# EAGLE schematic LRT_arduino_v2a (EAGLE 7.6.0)

## Sheet 1 of 4: MAIN CONTROLLER
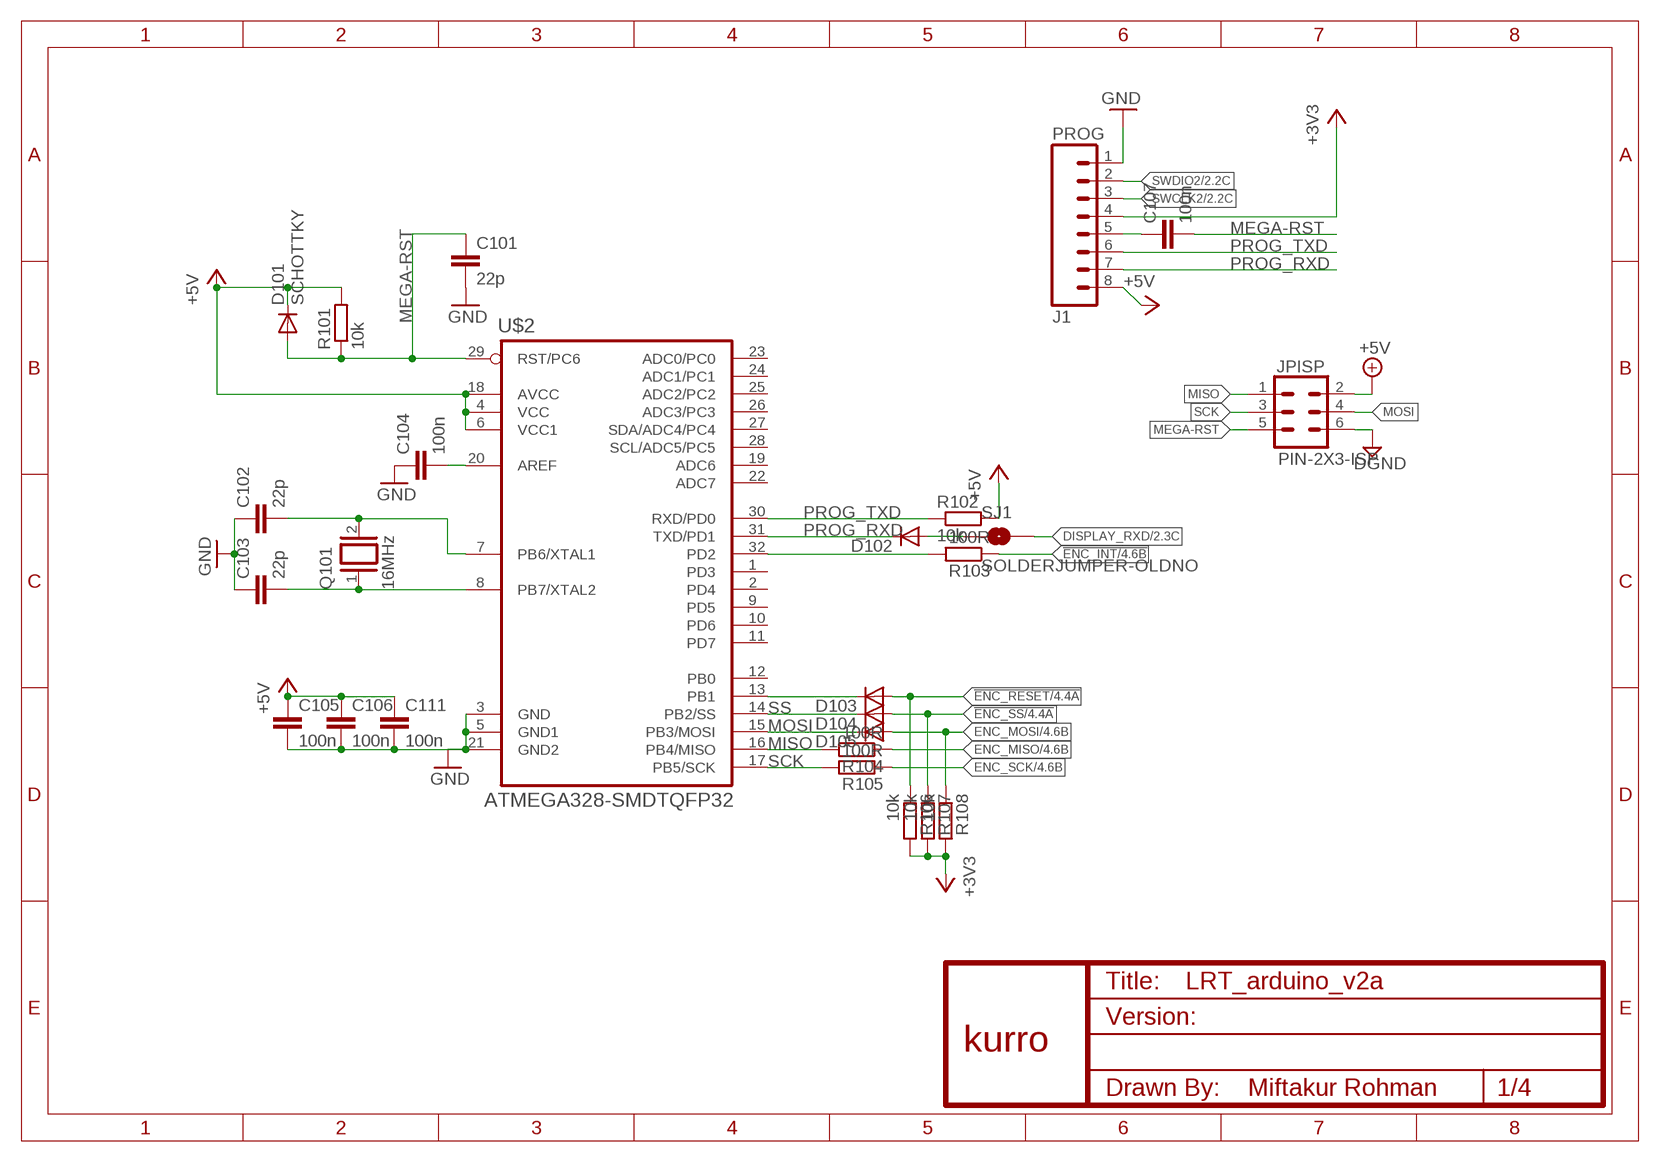
[diagram p0: schematic, sheet 1]

### Parts
C101  22p  C-EUC0603  [C0603]
C102  22p  C-EUC0603  [C0603]
C103  22p  C-EUC0603  [C0603]
C104  100n  C-EUC0603  [C0603]
C105  100n  C-EUC0603  [C0603]
C106  100n  C-EUC0603  [C0603]
C107  100n  C-EUC0603  [C0603]
C111  100n  C-EUC0603  [C0603]
D101  SCHOTTKY  DIODE-MICROMELF-W  [MICROMELF-W]
D102  DIODE-MICROMELF-W  [MICROMELF-W]
D103  DIODE-MICROMELF-W  [MICROMELF-W]
D104  DIODE-MICROMELF-W  [MICROMELF-W]
D105  DIODE-MICROMELF-W  [MICROMELF-W]
J1  PROG  M08-XH-RA  [XH-8-RA]
JPISP  PIN-2X3-ISP  PINHEAD-2X3-ISP  [2X03]
Q101  16MHz  XTAL/S  [QS]
R101  10k  R-EU_R0603  [R0603]
R102  10k  R-EU_R0603  [R0603]
R103  100R  R-EU_R0603  [R0603]
R104  100R  R-EU_R0603  [R0603]
R105  100R  R-EU_R0603  [R0603]
R106  10k  R-EU_R0603  [R0603]
R107  10k  R-EU_R0603  [R0603]
R108  10k  R-EU_R0603  [R0603]
SJ1  SOLDERJUMPER-OLDNO  [SJ_2S-NO]
U$1  KURRO_FOOTPRINT  [KURRO-LOGO]
U$2  ATMEGA328-SMDTQFP32  [TQFP32]

### Nets
!ENC_INT: R103.1 ; also sheet 4
!ENC_RESET: D103.A R106.1 ; also sheet 4
!ENC_SS: D104.A R107.1 ; also sheet 4
+3V3: J1.4 R106.2 R107.2 R108.2 ; also sheet 2,3,4
+5V: C105.1 C106.1 C111.1 D101.C J1.8 JPISP.2 R101.2 R102.2 U$2.4(VCC) U$2.6(VCC1) U$2.18(AVCC) ; also sheet 3
DISPLAY_RXD [ic]: SJ1.2 ; also sheet 2
ENC_MISO: R104.1 ; also sheet 4
ENC_MOSI: D105.A R108.1 ; also sheet 4
ENC_SCK: R105.1 ; also sheet 4
GND: C101.2 C102.1 C103.1 C104.1 C105.2 C106.2 C111.2 J1.1 JPISP.6 U$2.3(GND) U$2.5(GND1) U$2.21(GND2) ; supply symbol labelled DGND ; also sheet 2,3,4
MEGA-RST [ic]: C101.1 C107.2 D101.A JPISP.5 R101.1 U$2.29(RST/PC6)
MISO: JPISP.1 R104.2 U$2.16(PB4/MISO)
MOSI: D105.C JPISP.4 U$2.15(PB3/MOSI)
N$25: C104.2 U$2.20(AREF)
N$26: C103.2 Q101.1 U$2.8(PB7/XTAL2)
N$31: C102.2 Q101.2 U$2.7(PB6/XTAL1)
N$35: R103.2 U$2.32(PD2)
N$37 [ic]: C107.1 J1.5
N$39: D103.C U$2.13(PB1)
N$40: D102.A SJ1.1
PROG_RXD: D102.C J1.7 U$2.31(TXD/PD1)
PROG_TXD: J1.6 R102.1 U$2.30(RXD/PD0)
SCK: JPISP.3 R105.2 U$2.17(PB5/SCK)
SS: D104.C U$2.14(PB2/SS)
SWCLK2 [ic]: J1.3 ; also sheet 2
SWDIO2 [ic]: J1.2 ; also sheet 2
Unconnected: U$2.1(PD3) U$2.2(PD4) U$2.9(PD5) U$2.10(PD6) U$2.11(PD7) U$2.12(PB0) U$2.19(ADC6) U$2.22(ADC7) U$2.23(ADC0/PC0) U$2.24(ADC1/PC1) U$2.25(ADC2/PC2) U$2.26(ADC3/PC3) U$2.27(SDA/ADC4/PC4) U$2.28(SCL/ADC5/PC5)

## Sheet 2 of 4: DISPLAY_CONTROLLER
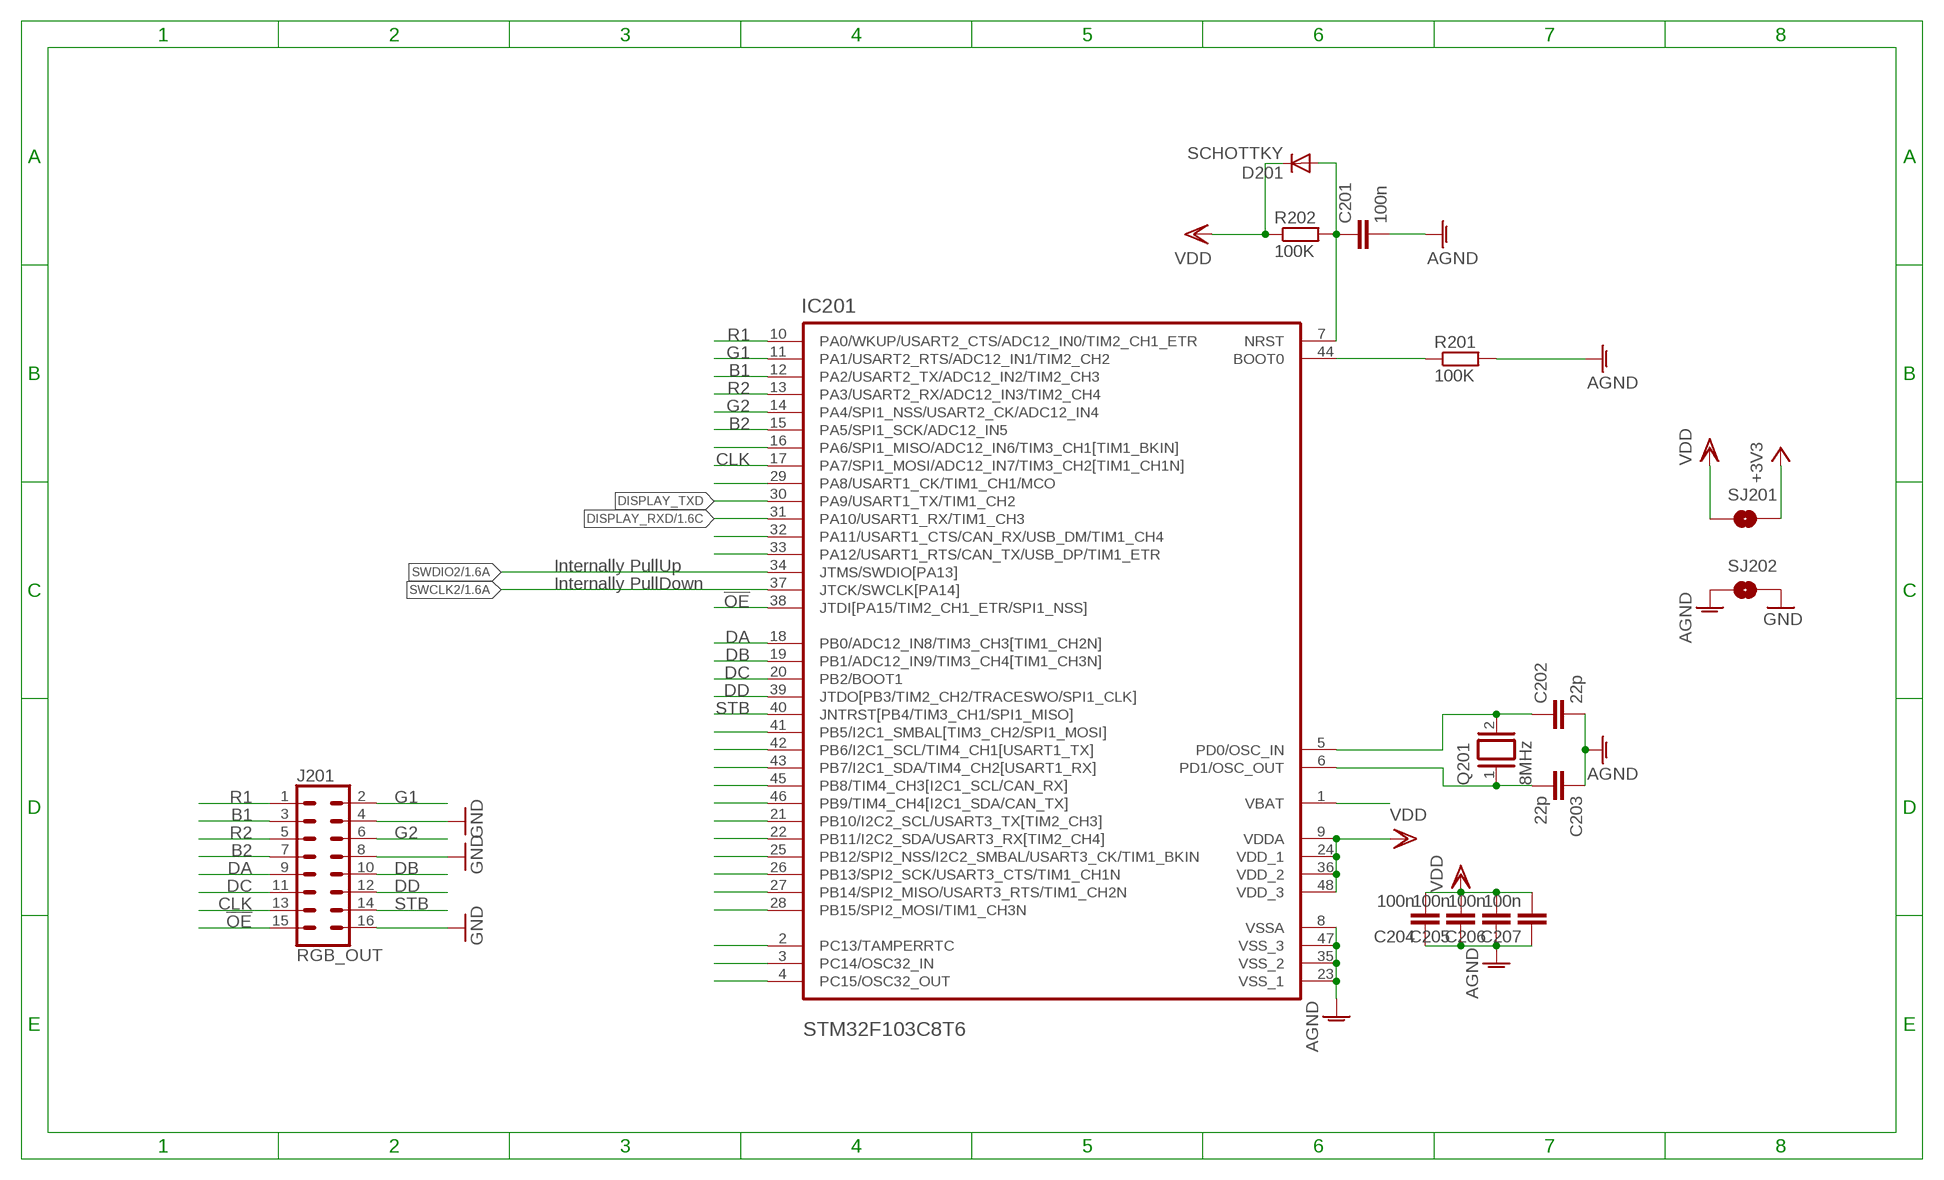
[diagram p1: schematic, sheet 2]

### Parts
C201  100n  C-EUC0603  [C0603]
C202  22p  C-EUC0603  [C0603]
C203  22p  C-EUC0603  [C0603]
C204  100n  C-EUC0603  [C0603]
C205  100n  C-EUC0603  [C0603]
C206  100n  C-EUC0603  [C0603]
C207  100n  C-EUC0603  [C0603]
D201  SCHOTTKY  DIODE-MICROMELF-W  [MICROMELF-W]
IC201  STM32F103C8T6  [QFP50P900X900X160-48N]
J201  RGB_OUT  PINHEAD-2X8  [2X08-LOCK]
Q201  8MHz  XTAL/S  [QS]
R201  100K  R-EU_R0603  [R0603]
R202  100K  R-EU_R0603  [R0603]
SJ201  SOLDERJUMPERTRACE  [SJ_2S-TRACE]
SJ202  SOLDERJUMPERTRACE  [SJ_2S-TRACE]

### Nets
!OE [ic]: IC201.38(JTDI[PA15/TIM2_CH1_ETR/SPI1_NSS]) J201.15
+3V3: SJ201.2 ; also sheet 1,3,4
AGND: C201.2 C202.2 C203.1 C204.1 C205.1 C206.1 C207.1 IC201.8(VSSA) IC201.23(VSS_1) IC201.35(VSS_2) IC201.47(VSS_3) R201.2 SJ202.1
B1 [ic]: IC201.12(PA2/USART2_TX/ADC12_IN2/TIM2_CH3) J201.3
B2 [ic]: IC201.15(PA5/SPI1_SCK/ADC12_IN5) J201.7
BOOT0 [ic]: IC201.44(BOOT0) R201.1
CLK [ic]: IC201.17(PA7/SPI1_MOSI/ADC12_IN7/TIM3_CH2[TIM1_CH1N]) J201.13
DA [ic]: IC201.18(PB0/ADC12_IN8/TIM3_CH3[TIM1_CH2N]) J201.9
DB [ic]: IC201.19(PB1/ADC12_IN9/TIM3_CH4[TIM1_CH3N]) J201.10
DC [ic]: IC201.20(PB2/BOOT1) J201.11
DD [ic]: IC201.39(JTDO[PB3/TIM2_CH2/TRACESWO/SPI1_CLK]) J201.12
DISPLAY_RXD [ic]: IC201.31(PA10/USART1_RX/TIM1_CH3) ; also sheet 1
DISPLAY_TXD [ic]: IC201.30(PA9/USART1_TX/TIM1_CH2)
G1 [ic]: IC201.11(PA1/USART2_RTS/ADC12_IN1/TIM2_CH2) J201.2
G2 [ic]: IC201.14(PA4/SPI1_NSS/USART2_CK/ADC12_IN4) J201.6
GND: J201.4 J201.8 J201.16 SJ202.2 ; also sheet 1,3,4
N$1 [ic]: IC201.29(PA8/USART1_CK/TIM1_CH1/MCO)
N$2 [ic]: IC201.45(PB8/TIM4_CH3[I2C1_SCL/CAN_RX])
N$6 [ic]: C203.2 IC201.6(PD1/OSC_OUT) Q201.1
N$7 [ic]: C202.1 IC201.5(PD0/OSC_IN) Q201.2
N$8 [ic]: IC201.46(PB9/TIM4_CH4[I2C1_SDA/CAN_TX])
N$11 [ic]: IC201.3(PC14/OSC32_IN)
N$13 [ic]: IC201.42(PB6/I2C1_SCL/TIM4_CH1[USART1_TX])
N$14 [ic]: IC201.43(PB7/I2C1_SDA/TIM4_CH2[USART1_RX])
N$15 [ic]: IC201.21(PB10/I2C2_SCL/USART3_TX[TIM2_CH3])
N$16 [ic]: IC201.22(PB11/I2C2_SDA/USART3_RX[TIM2_CH4])
N$24 [ic]: IC201.32(PA11/USART1_CTS/CAN_RX/USB_DM/TIM1_CH4)
N$27 [ic]: IC201.25(PB12/SPI2_NSS/I2C2_SMBAL/USART3_CK/TIM1_BKIN)
N$28 [ic]: IC201.26(PB13/SPI2_SCK/USART3_CTS/TIM1_CH1N)
N$29 [ic]: IC201.27(PB14/SPI2_MISO/USART3_RTS/TIM1_CH2N)
N$30 [ic]: IC201.28(PB15/SPI2_MOSI/TIM1_CH3N)
N$36 [ic]: IC201.2(PC13/TAMPERRTC)
N$42 [ic]: IC201.16(PA6/SPI1_MISO/ADC12_IN6/TIM3_CH1[TIM1_BKIN])
N$46 [ic]: IC201.33(PA12/USART1_RTS/CAN_TX/USB_DP/TIM1_ETR)
N$51 [ic]: IC201.41(PB5/I2C1_SMBAL[TIM3_CH2/SPI1_MOSI])
N$57 [ic]: IC201.4(PC15/OSC32_OUT)
N$58 [ic]: IC201.1(VBAT)
R1 [ic]: IC201.10(PA0/WKUP/USART2_CTS/ADC12_IN0/TIM2_CH1_ETR) J201.1
R2 [ic]: IC201.13(PA3/USART2_RX/ADC12_IN3/TIM2_CH4) J201.5
RST [ic]: C201.1 D201.A IC201.7(NRST) R202.2
STB [ic]: IC201.40(JNTRST[PB4/TIM3_CH1/SPI1_MISO]) J201.14
SWCLK2 [ic]: IC201.37(JTCK/SWCLK[PA14]) ; also sheet 1
SWDIO2 [ic]: IC201.34(JTMS/SWDIO[PA13]) ; also sheet 1
VDD [ic]: C204.2 C205.2 C206.2 C207.2 D201.C IC201.9(VDDA) IC201.24(VDD_1) IC201.36(VDD_2) IC201.48(VDD_3) R202.1 SJ201.1

### Notes on the sheet
- Internally PullUp
- Internally PullDown

## Sheet 3 of 4: PSU
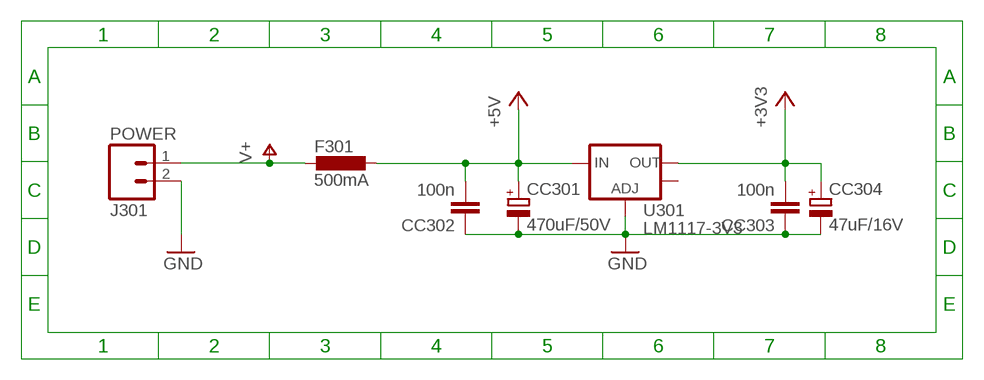
[diagram p2: schematic, sheet 3]

### Parts
CC301  470uF/50V  CPOL-EUE2-5  [E2-5]
CC302  100n  C-EUC0603  [C0603]
CC303  100n  C-EUC0603  [C0603]
CC304  47uF/16V  CPOL-EUE2-5  [E2-5]
F301  500mA  L-EUL0805  [L0805]
J301  POWER  M02-XH-RA  [XH-2-RA]
U301  LM1117-3V3  V_REG_LM1117SOT223  [SOT223]

### Nets
+3V3: CC303.2 CC304.+ U301.2(OUT) ; also sheet 1,2,4
+5V: CC301.+ CC302.2 F301.1 U301.3(IN) ; also sheet 1
GND: CC301.- CC302.1 CC303.1 CC304.- J301.2 U301.1(ADJ) ; also sheet 1,2,4
V+: F301.2 J301.1
Unconnected: U301.4(OUT)

## Sheet 4 of 4: ENC28J60
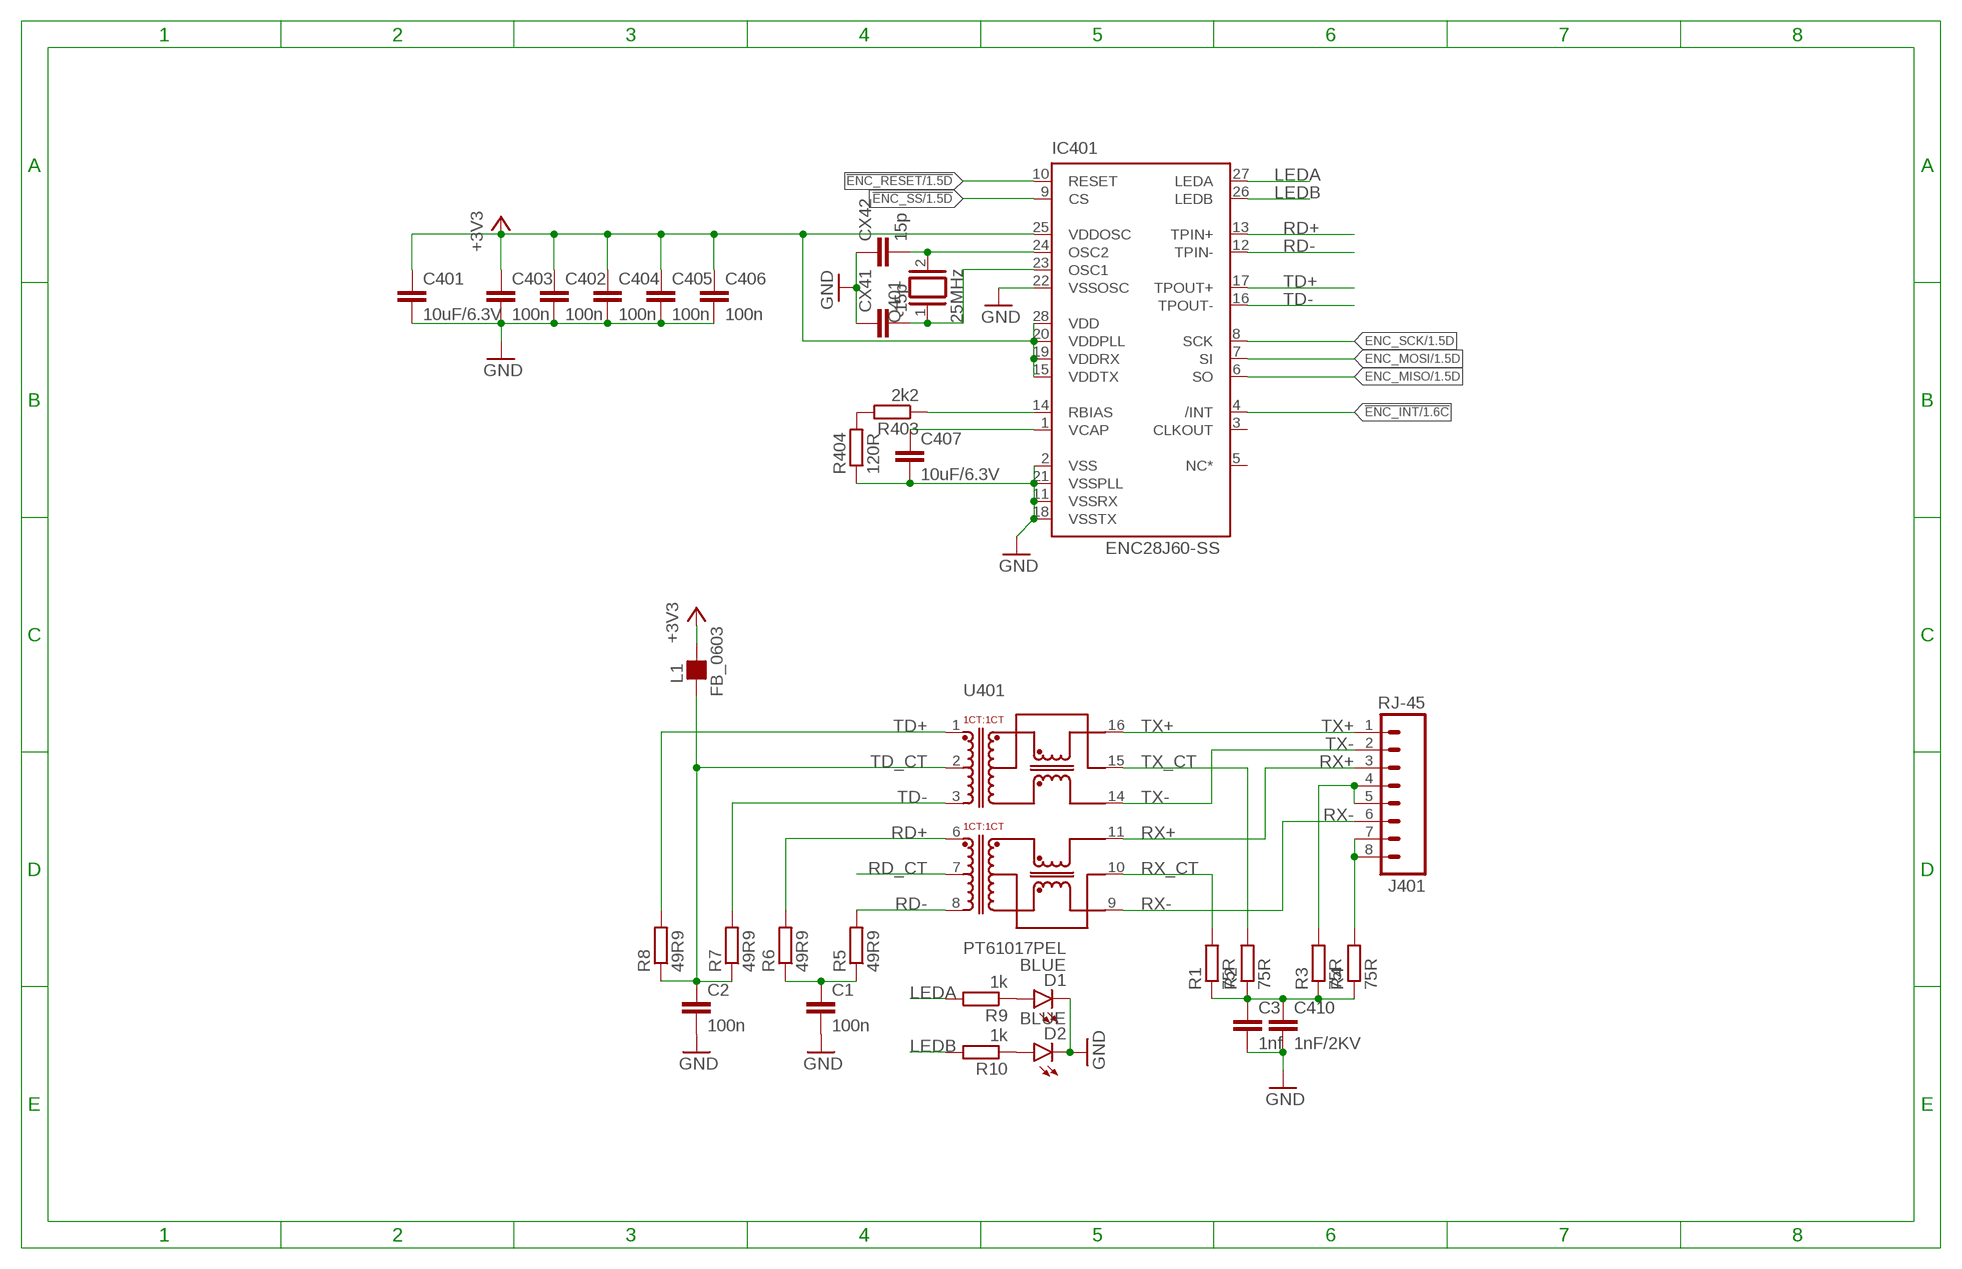
[diagram p3: schematic, sheet 4]

### Parts
C1  100n  C-EUC0603  [C0603]
C2  100n  C-EUC0603  [C0603]
C3  1nf  C-EUC0603  [C0603]
C401  10uF/6.3V  C-EUC0805  [C0805]
C402  100n  C-EUC0603  [C0603]
C403  100n  C-EUC0603  [C0603]
C404  100n  C-EUC0603  [C0603]
C405  100n  C-EUC0603  [C0603]
C406  100n  C-EUC0603  [C0603]
C407  10uF/6.3V  C-EUC0805  [C0805]
C410  1nF/2KV  C-EU050-055X075  [C050-055X075]
CX41  15p  C-EUC0603  [C0603]
CX42  15p  C-EUC0603  [C0603]
D1  BLUE  LED-BLUE1206  [LED-1206]
D2  BLUE  LED-BLUE1206  [LED-1206]
IC401  ENC28J60-SS  [SS28]
J401  RJ-45  M08-XH-RA  [XH-8-RA]
L1  FB_0603  [L0603]
Q401  25MHz  XTAL/S  [QS]
R1  75R  R-EU_R0603  [R0603]
R2  75R  R-EU_R0603  [R0603]
R3  75R  R-EU_R0603  [R0603]
R4  75R  R-EU_R0603  [R0603]
R5  49R9  R-EU_R0603  [R0603]
R6  49R9  R-EU_R0603  [R0603]
R7  49R9  R-EU_R0603  [R0603]
R8  49R9  R-EU_R0603  [R0603]
R9  1k  R-EU_R0603  [R0603]
R10  1k  R-EU_R0603  [R0603]
R403  2k2  R-EU_R0603  [R0603]
R404  120R  R-EU_R0603  [R0603]
U401  PT61017PEL  [PT61017]

### Nets
!ENC_INT: IC401.4(/INT) ; also sheet 1
!ENC_RESET: IC401.10(RESET) ; also sheet 1
!ENC_SS: IC401.9(CS) ; also sheet 1
+3V3: C401.1 C402.1 C403.1 C404.1 C405.1 C406.1 IC401.15(VDDTX) IC401.19(VDDRX) IC401.20(VDDPLL) IC401.25(VDDOSC) IC401.28(VDD) L1.2 ; also sheet 1,2,3
ENC_MISO: IC401.6(SO) ; also sheet 1
ENC_MOSI: IC401.7(SI) ; also sheet 1
ENC_SCK: IC401.8(SCK) ; also sheet 1
GND: C1.2 C2.2 C3.2 C401.2 C402.2 C403.2 C404.2 C405.2 C406.2 C407.2 C410.2 CX41.1 CX42.1 D1.C D2.C IC401.2(VSS) IC401.11(VSSRX) IC401.18(VSSTX) IC401.21(VSSPLL) IC401.22(VSSOSC) R404.1 ; also sheet 1,2,3
LEDA: IC401.27(LEDA) R9.2
LEDB: IC401.26(LEDB) R10.2
N$3: D1.A R9.1
N$4: D2.A R10.1
N$5: C3.1 C410.1 R1.1 R2.1 R3.1 R4.1
N$9: J401.4 J401.5 R3.2
N$10: R403.2 R404.2
N$12: C407.1 IC401.1(VCAP)
N$17: J401.7 J401.8 R4.2
N$18: CX42.2 IC401.24(OSC2) Q401.2
N$19: CX41.2 IC401.23(OSC1) Q401.1
N$20: C1.1 R5.1 R6.1
N$23: IC401.14(RBIAS) R403.1
RD+: IC401.13(TPIN+) R6.2 U401.6
RD-: IC401.12(TPIN-) R5.2 U401.8
RD_CT: U401.7
RX+: J401.3 U401.11
RX-: J401.6 U401.9
RX_CT: R1.2 U401.10
TD+: IC401.17(TPOUT+) R8.2 U401.1
TD-: IC401.16(TPOUT-) R7.2 U401.3
TD_CT: C2.1 L1.1 R7.1 R8.1 U401.2
TX+: J401.1 U401.16
TX-: J401.2 U401.14
TX_CT: R2.2 U401.15
Unconnected: IC401.3(CLKOUT) IC401.5(NC*)

## Library data of the parts
C1-C3 C102 C103 C401-C407 CX41 CX42 = rcl:C-EU: CAPACITOR, European symbol
C101 C104-C107 C111 C201-C207 C410 CC302 CC303 = resistor:C-EU: CAPACITOR, European symbol
CC301 CC304 = rcl:CPOL-EU: POLARIZED CAPACITOR, European symbol
D1 D2 = SparkFun-LED:LED-BLUE: Blue LEDs for production use Various blue LEDs stocked by SparkFun production 0603 - DIO-08575 Rebel - DIO-09553 1206 - DIO-09911; PROD_ID: DIO-09911
D101-D105 D201 = diode:DIODE-: DIODE
F301 = rcl:L-EU: INDUCTOR, European symbol
IC201 = ST Microelctronics_By_element14_Batch_1:STM32F103C8T6: Medium-density performance line ARM-based 32-bit MCU; LINK: https://www.tokopedia.com/embedded-world/stm32-stm32f103c8t6-lqfp48-arm-based-microcontroller-mcu-lqfp-48-au02; MPN: STM32F103CBT6; OC_FARNELL: 1606327; OC_NEWARK: 11N8296; PACKAGE: QFP-48; SUPPLIER: STMICROELECTRONICS
IC401 = edes_library:ENC28J60: ethernet controller
J1 J401 = SparkFun-Connectors:M08: Header 8 Standard 8-pin 0.1" header. Use with straight break away headers (SKU : PRT-00116), right angle break away headers (PRT-00553), swiss pins (PRT-00743), machine pins (PRT-00117), and female headers (PRT-00115).
J201 = edes_lib_160827:PINHEAD-2X8
J301 = SparkFun-Connectors:M02: Standard 2-pin 0.1" header. Use with - straight break away headers ( PRT-00116) - right angle break away headers (PRT-00553) - swiss pins (PRT-00743) - machine pins (PRT-00117) - female headers (PRT-00115) Molex polarized connector foot print use with: PRT-08233 with associated crimp pins and housings. 2.54_SCREWTERM for use with PRT-10571. 3.5mm Screw Terminal footprints for PRT-08084 5mm Screw Terminal footprints for use with PRT-08433
JPISP = edes_lib_160827:PINHEAD-2X3
L1 = rc-master:FB_: FERRITE BEAD
Q101 Q201 Q401 = special:XTAL/S: CRYSTAL
R1-R10 R101-R108 R403 R404 = rcl:R-EU_: RESISTOR, European symbol
R201 R202 = resistor:R-EU_: RESISTOR, European symbol
SJ1 = SparkFun-Retired:SOLDERJUMPER-OLD: Solder Jumper Standard SMD solder jumper. Used to automate production. Two varients : Normally Open and Normally Closed are the same, but have different paste layers. NC will have a large amount of paste and should jumper during reflow.
SJ201 SJ202 = SparkFun-Passives:SOLDERJUMPER: Solder Jumper Standard SMD solder jumper. Used to automate production. Two varients : Normally Open and Normally Closed are the same, but have different paste layers. NC will have a large amount of paste and should jumper during reflow.
U301 = SparkFun-PowerIC:V_REG_LM1117: Voltage Regulator LM1117 Standard adjustable voltage regulator but in SMD form. Spark Fun Electronics SKU : COM-00595; PROD_ID: VREG-08170
U401 = Bourns_By_element14_Batch_1:PT61017: Audio Transformers / Signal Transformers LAN 10/100 Tin Potted PT61017PEL Datasheet <https://www.mouser.co.id/datasheet/2/54/t61017pel-777480.pdf>
U$1 = SparkFun:KURRO_FOOTPRINT
U$2 = edes_lib_160827:ATMEGA328*-SMD

## Net classes
0 default: width 0.406 mm, drill 0.59 mm, clearance 0.305 mm
1 ic: width 0.254 mm, drill 0.59 mm, clearance 0.203 mm